# Altium schematic sheet connectors.SchDoc
size Letter
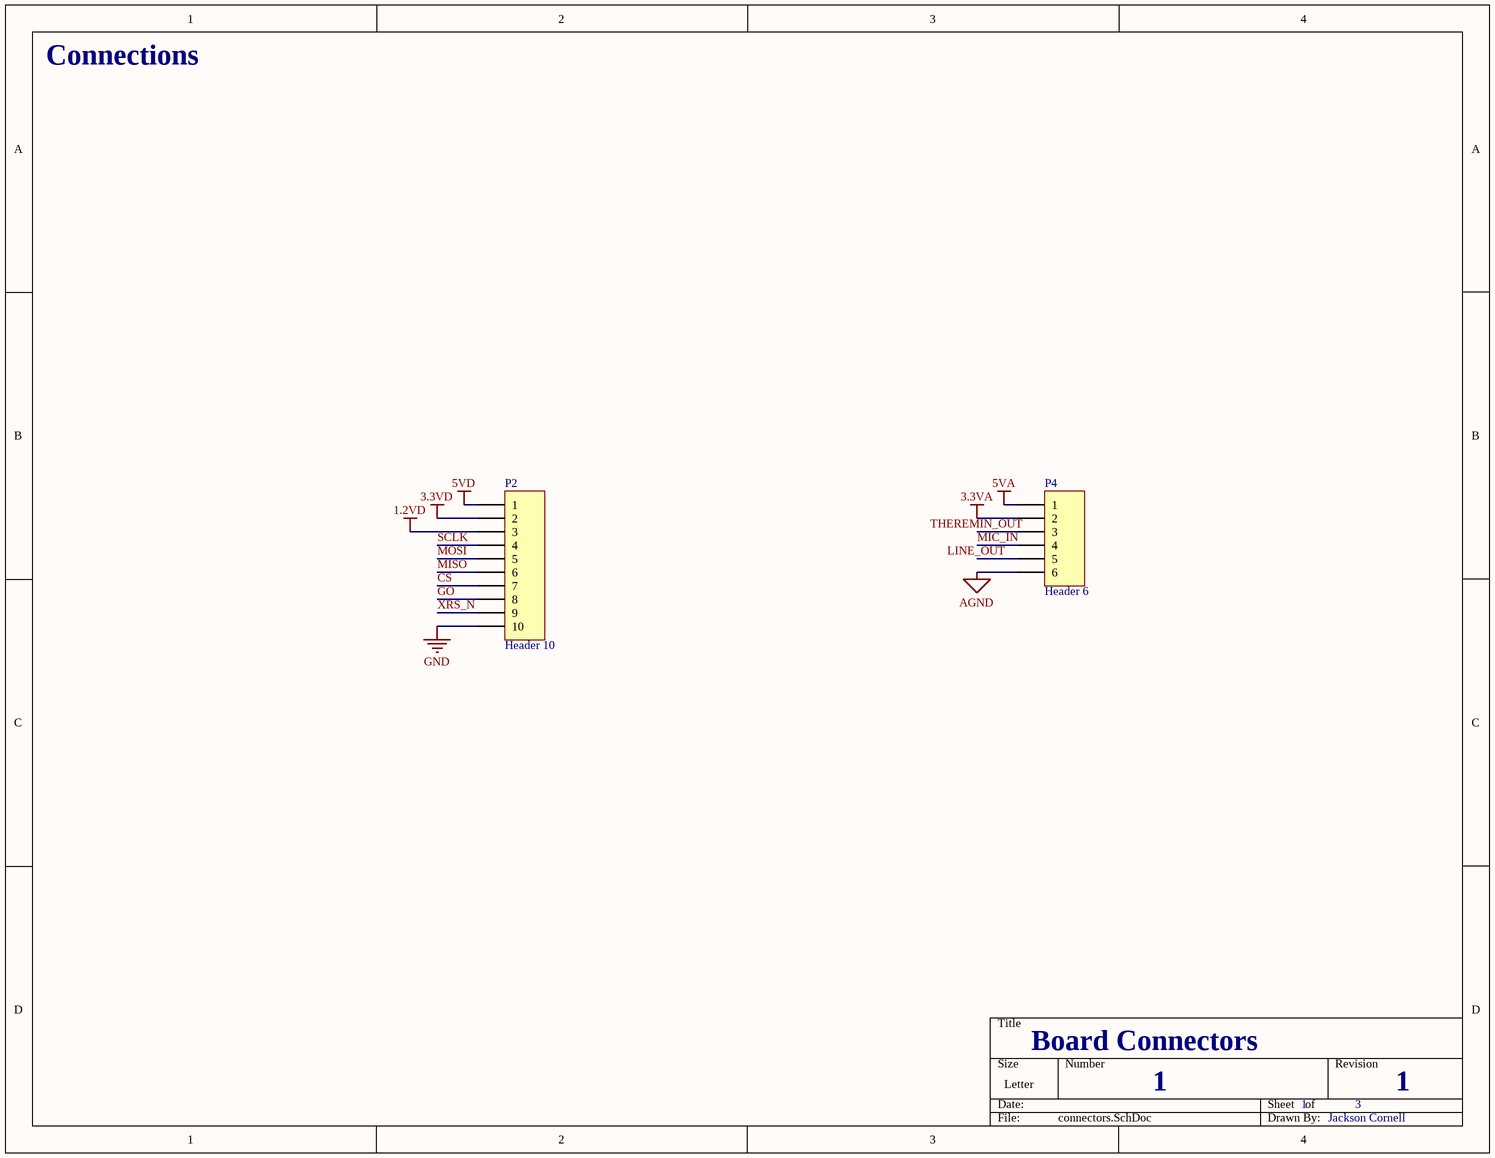
[diagram p0: connectors.SchDoc]

## Parts
P2  Header 10  [HDR1X10]
P4  Header 6  [HDR1X6]

## Nets
1.2VD: P2.3
3.3VA: P4.2
3.3VD: P2.2
5VA: P4.1
5VD: P2.1
AGND: P4.6
GND: P2.10
CS: P2.7
GO: P2.8
LINE_OUT: P4.5
MIC_IN: P4.4
MISO: P2.6
MOSI: P2.5
SCLK: P2.4
THEREMIN_OUT: P4.3
XRS_N: P2.9

## Notes on the sheet
- Connections
- Board Connectors
- 1
- 3
- Jackson Cornell

## Library data of the parts
P2 = Header 10: Header, 10-Pin; LatestRevisionDate: 17-Jul-2002; LatestRevisionNote: Re-released for DXP Platform.; Publisher: Altium Limited
P4 = Header 6: Header, 6-Pin; LatestRevisionDate: 17-Jul-2002; LatestRevisionNote: Re-released for DXP Platform.; Publisher: Altium Limited